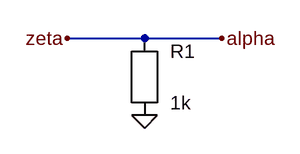
[diagram p0: schematic two_labels_zeta_first.asc]
two_labels_zeta_first.asc, the LTspice schematic file:
Version 4
SHEET 1 880 680
WIRE 0 96 192 96
SYMBOL res 96 144 R0
SYMATTR InstName R1
SYMATTR Value 1k
FLAG 96 192 0
FLAG 0 96 zeta
FLAG 192 96 alpha

The netlist it stands for:
* two_labels_zeta_first.asc
R1 alpha 0 1k
.backanno
.end